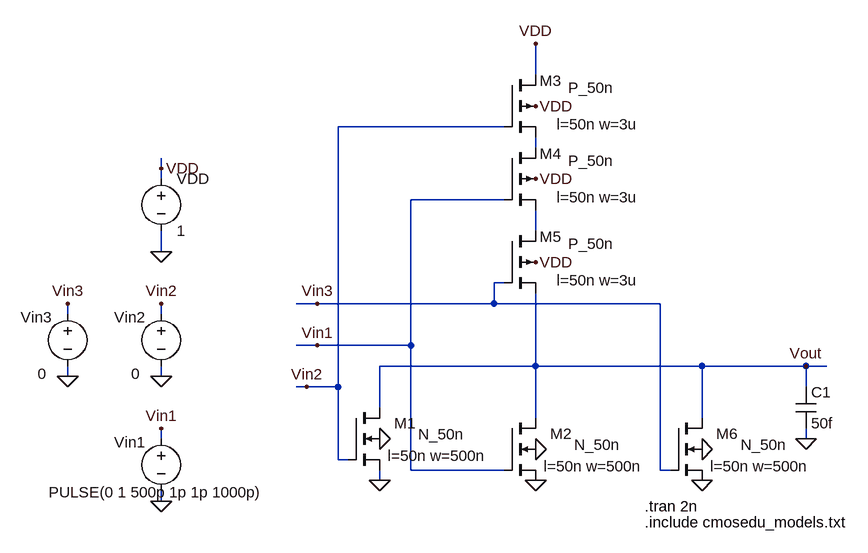
[diagram p0: schematic 8-NOR3.asc]
8-NOR3.asc, the LTspice schematic file:
Version 4
SHEET 1 1220 680
WIRE 736 -640 736 -688
WIRE 688 -560 432 -560
WIRE 736 -528 736 -544
WIRE 160 -496 160 -512
WIRE 160 -480 160 -496
WIRE 688 -448 544 -448
WIRE 736 -400 736 -432
WIRE 160 -368 160 -400
WIRE 688 -320 672 -320
WIRE 400 -288 368 -288
WIRE 672 -288 672 -320
WIRE 672 -288 400 -288
WIRE 928 -288 672 -288
WIRE 16 -272 16 -288
WIRE 160 -272 160 -288
WIRE 400 -224 368 -224
WIRE 544 -224 544 -448
WIRE 544 -224 400 -224
WIRE 736 -192 736 -304
WIRE 736 -192 496 -192
WIRE 992 -192 736 -192
WIRE 1152 -192 992 -192
WIRE 1184 -192 1152 -192
WIRE 16 -176 16 -192
WIRE 160 -176 160 -192
WIRE 384 -160 368 -160
WIRE 432 -160 432 -560
WIRE 432 -160 384 -160
WIRE 1152 -160 1152 -192
WIRE 496 -128 496 -192
WIRE 736 -112 736 -192
WIRE 992 -112 992 -192
WIRE 160 -80 160 -96
WIRE 1152 -80 1152 -96
WIRE 432 -48 432 -160
WIRE 448 -48 432 -48
WIRE 544 -32 544 -224
WIRE 688 -32 544 -32
WIRE 928 -32 928 -288
WIRE 944 -32 928 -32
WIRE 496 -16 496 -32
WIRE 160 16 160 0
FLAG 160 16 0
FLAG 160 -96 Vin1
FLAG 736 -64 0
FLAG 160 -368 0
FLAG 160 -496 VDD
FLAG 736 -592 VDD
FLAG 496 -16 0
FLAG 736 -688 VDD
FLAG 1152 -192 Vout
FLAG 736 -480 VDD
FLAG 496 -80 0
FLAG 1152 -80 0
FLAG 400 -224 Vin1
FLAG 384 -160 Vin2
FLAG 160 -176 0
FLAG 160 -288 Vin2
FLAG 736 -16 0
FLAG 736 -352 VDD
FLAG 992 -64 0
FLAG 992 -16 0
FLAG 400 -288 Vin3
FLAG 16 -176 0
FLAG 16 -288 Vin3
SYMBOL voltage 160 -96 R0
WINDOW 0 -72 21 Left 2
WINDOW 3 -173 98 Left 2
WINDOW 123 0 0 Left 2
WINDOW 39 0 0 Left 2
SYMATTR InstName Vin1
SYMATTR Value PULSE(0 1 500p 1p 1p 1000p)
SYMBOL voltage 160 -496 R0
WINDOW 123 0 0 Left 2
WINDOW 39 0 0 Left 2
SYMATTR InstName VDD
SYMATTR Value 1
SYMBOL pmos4 688 -640 R0
WINDOW 0 88 9 Right 2
WINDOW 3 168 20 Right 2
WINDOW 123 206 76 Right 2
SYMATTR InstName M3
SYMATTR Value P_50n
SYMATTR Value2 l=50n w=3u
SYMBOL nmos4 448 -128 R0
WINDOW 0 104 24 Right 2
WINDOW 3 179 41 Right 2
WINDOW 123 213 74 Right 2
SYMATTR InstName M1
SYMATTR Value N_50n
SYMATTR Value2 l=50n w=500n
SYMBOL nmos4 688 -112 R0
WINDOW 0 104 24 Right 2
WINDOW 3 179 41 Right 2
WINDOW 123 213 74 Right 2
SYMATTR InstName M2
SYMATTR Value N_50n
SYMATTR Value2 l=50n w=500n
SYMBOL pmos4 688 -528 R0
WINDOW 0 88 9 Right 2
WINDOW 3 168 20 Right 2
WINDOW 123 206 76 Right 2
SYMATTR InstName M4
SYMATTR Value P_50n
SYMATTR Value2 l=50n w=3u
SYMBOL cap 1136 -160 R0
SYMATTR InstName C1
SYMATTR Value 50f
SYMBOL voltage 160 -288 R0
WINDOW 0 -72 21 Left 2
WINDOW 3 -46 108 Left 2
WINDOW 123 0 0 Left 2
WINDOW 39 0 0 Left 2
SYMATTR InstName Vin2
SYMATTR Value 0
SYMBOL pmos4 688 -400 R0
WINDOW 0 88 9 Right 2
WINDOW 3 168 20 Right 2
WINDOW 123 206 76 Right 2
SYMATTR InstName M5
SYMATTR Value P_50n
SYMATTR Value2 l=50n w=3u
SYMBOL nmos4 944 -112 R0
WINDOW 0 104 24 Right 2
WINDOW 3 179 41 Right 2
WINDOW 123 213 74 Right 2
SYMATTR InstName M6
SYMATTR Value N_50n
SYMATTR Value2 l=50n w=500n
SYMBOL voltage 16 -288 R0
WINDOW 0 -72 21 Left 2
WINDOW 3 -46 108 Left 2
WINDOW 123 0 0 Left 2
WINDOW 39 0 0 Left 2
SYMATTR InstName Vin3
SYMATTR Value 0
TEXT 904 24 Left 2 !.tran 2n
TEXT 904 48 Left 2 !.include cmosedu_models.txt

The netlist it stands for:
* 8-NOR3.asc
Vin1 Vin1 0 PULSE(0 1 500p 1p 1p 1000p)
VDD VDD 0 1
M3 VDD Vin2 N001 VDD P_50n l=50n w=3u
M1 Vout Vin2 0 0 N_50n l=50n w=500n
M2 Vout Vin1 0 0 N_50n l=50n w=500n
M4 N001 Vin1 N002 VDD P_50n l=50n w=3u
C1 Vout 0 50f
Vin2 Vin2 0 0
M5 N002 Vin3 Vout VDD P_50n l=50n w=3u
M6 Vout Vin3 0 0 N_50n l=50n w=500n
Vin3 Vin3 0 0
.model NMOS NMOS
.model PMOS PMOS
.lib standard.mos
.tran 2n
.include cmosedu_models.txt
.backanno
.end